# Altium schematic sheet driver.SchDoc
size 320 x 199 mm; SheetNumber: 3; SheetTotal: 4
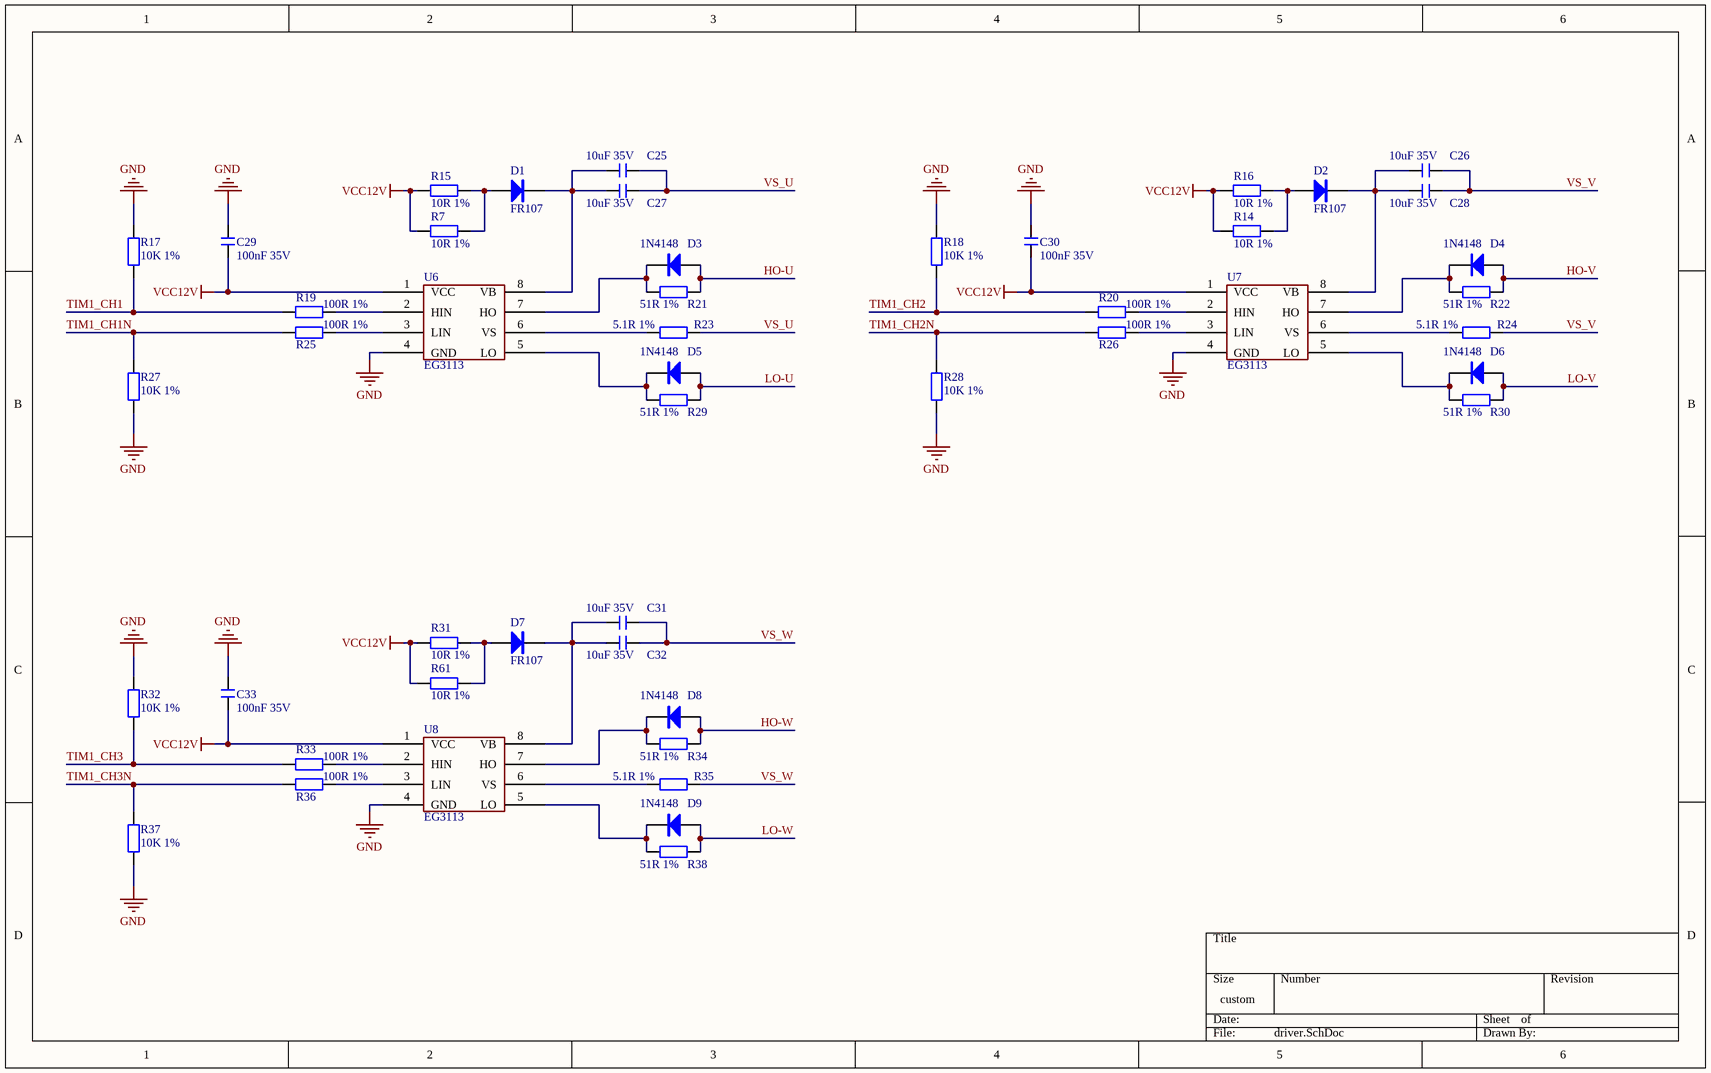
[diagram p0: driver.SchDoc]

## Parts
C25  10uF 35V  [C1206_L]
C26  10uF 35V  [C1206_L]
C27  10uF 35V  [C1206_L]
C28  10uF 35V  [C1206_L]
C29  100nF 35V  [C0603_L]
C30  100nF 35V  [C0603_L]
C31  10uF 35V  [C1206_L]
C32  10uF 35V  [C1206_L]
C33  100nF 35V  [C0603_L]
D1  FR107  [SOD-123]
D2  FR107  [SOD-123]
D3  1N4148  [SOD-323]
D4  1N4148  [SOD-323]
D5  1N4148  [SOD-323]
D6  1N4148  [SOD-323]
D7  FR107  [SOD-123]
D8  1N4148  [SOD-323]
D9  1N4148  [SOD-323]
R7  10R 1%  [R0603_l]
R14  10R 1%  [R0603_l]
R15  10R 1%  [R0603_l]
R16  10R 1%  [R0603_l]
R17  10K 1%  [R0603_l]
R18  10K 1%  [R0603_l]
R19  100R 1%  [R0603_l]
R20  100R 1%  [R0603_l]
R21  51R 1%  [R0603_l]
R22  51R 1%  [R0603_l]
R23  5.1R 1%  [R0603_l]
R24  5.1R 1%  [R0603_l]
R25  100R 1%  [R0603_l]
R26  100R 1%  [R0603_l]
R27  10K 1%  [R0603_l]
R28  10K 1%  [R0603_l]
R29  51R 1%  [R0603_l]
R30  51R 1%  [R0603_l]
R31  10R 1%  [R0603_l]
R32  10K 1%  [R0603_l]
R33  100R 1%  [R0603_l]
R34  51R 1%  [R0603_l]
R35  5.1R 1%  [R0603_l]
R36  100R 1%  [R0603_l]
R37  10K 1%  [R0603_l]
R38  51R 1%  [R0603_l]
R61  10R 1%  [R0603_l]
U6  EG3113  [SOP-8]
U7  EG3113  [SOP-8]
U8  EG3113  [SOP-8]

## Nets
GND: C29.1 C30.1 C33.1 R17.2 R18.2 R27.1 R28.1 R32.2 R37.1 U6.4(GND) U7.4(GND) U8.4(GND)
VCC12V: C29.2 C30.2 C33.2 R7.1 R14.1 R15.1 R16.1 R31.1 R61.1 U6.1(VCC) U7.1(VCC) U8.1(VCC)
HO-U: D3.1(A) R21.2
HO-V: D4.1(A) R22.2
HO-W: D8.1(A) R34.2
LO-U: D5.1(A) R29.2
LO-V: D6.1(A) R30.2
LO-W: D9.1(A) R38.2
TIM1_CH1: R17.1 R19.1
TIM1_CH1N: R25.1 R27.2
TIM1_CH2: R18.1 R20.1
TIM1_CH2N: R26.1 R28.2
TIM1_CH3: R32.1 R33.1
TIM1_CH3N: R36.1 R37.2
VS_U: C25.1 C27.1 R23.2
VS_V: C26.1 C28.1 R24.2
VS_W: C31.1 C32.1 R35.2
NetC25_2: C25.2 C27.2 D1.2(K) U6.8(VB)
NetC26_2: C26.2 C28.2 D2.2(K) U7.8(VB)
NetC31_2: C31.2 C32.2 D7.2(K) U8.8(VB)
NetD1_1: D1.1(A) R7.2 R15.2
NetD2_1: D2.1(A) R14.2 R16.2
NetD3_2: D3.2(K) R21.1 U6.7(HO)
NetD4_2: D4.2(K) R22.1 U7.7(HO)
NetD5_2: D5.2(K) R29.1 U6.5(LO)
NetD6_2: D6.2(K) R30.1 U7.5(LO)
NetD7_1: D7.1(A) R31.2 R61.2
NetD8_2: D8.2(K) R34.1 U8.7(HO)
NetD9_2: D9.2(K) R38.1 U8.5(LO)
NetR19_2: R19.2 U6.2(HIN)
NetR20_2: R20.2 U7.2(HIN)
NetR23_1: R23.1 U6.6(VS)
NetR24_1: R24.1 U7.6(VS)
NetR25_2: R25.2 U6.3(LIN)
NetR26_2: R26.2 U7.3(LIN)
NetR33_2: R33.2 U8.2(HIN)
NetR35_1: R35.1 U8.6(VS)
NetR36_2: R36.2 U8.3(LIN)

## Library data of the parts
C25-C33 = C: 无极性贴片电容; 版权归属: 源创客; 材质: X7R; BOM名称: 无极性贴片电容; 学习资源: www.ooocke.com
D1 D2 D7 = FR107: 快恢复整流二极管; BOM名称: 快恢复二极管; 版权归属: 源创客; 属性: 700V/1A; 学习资源: www.ooocke.com
D3-D6 D8 D9 = 1N4148: 高速开关二极管; 版权归属: 源创客; BOM名称: 高速开关二极管; 学习资源: www.ooocke.com
R7 R14-R38 R61 = R: 贴片电阻; 版权归属: 源创客; BOM名称: 贴片电阻; 学习资源: www.ooocke.com
U6-U8 = EG3113: 栅极驱动